# EAGLE design RF12 board (EAGLE 5.08)
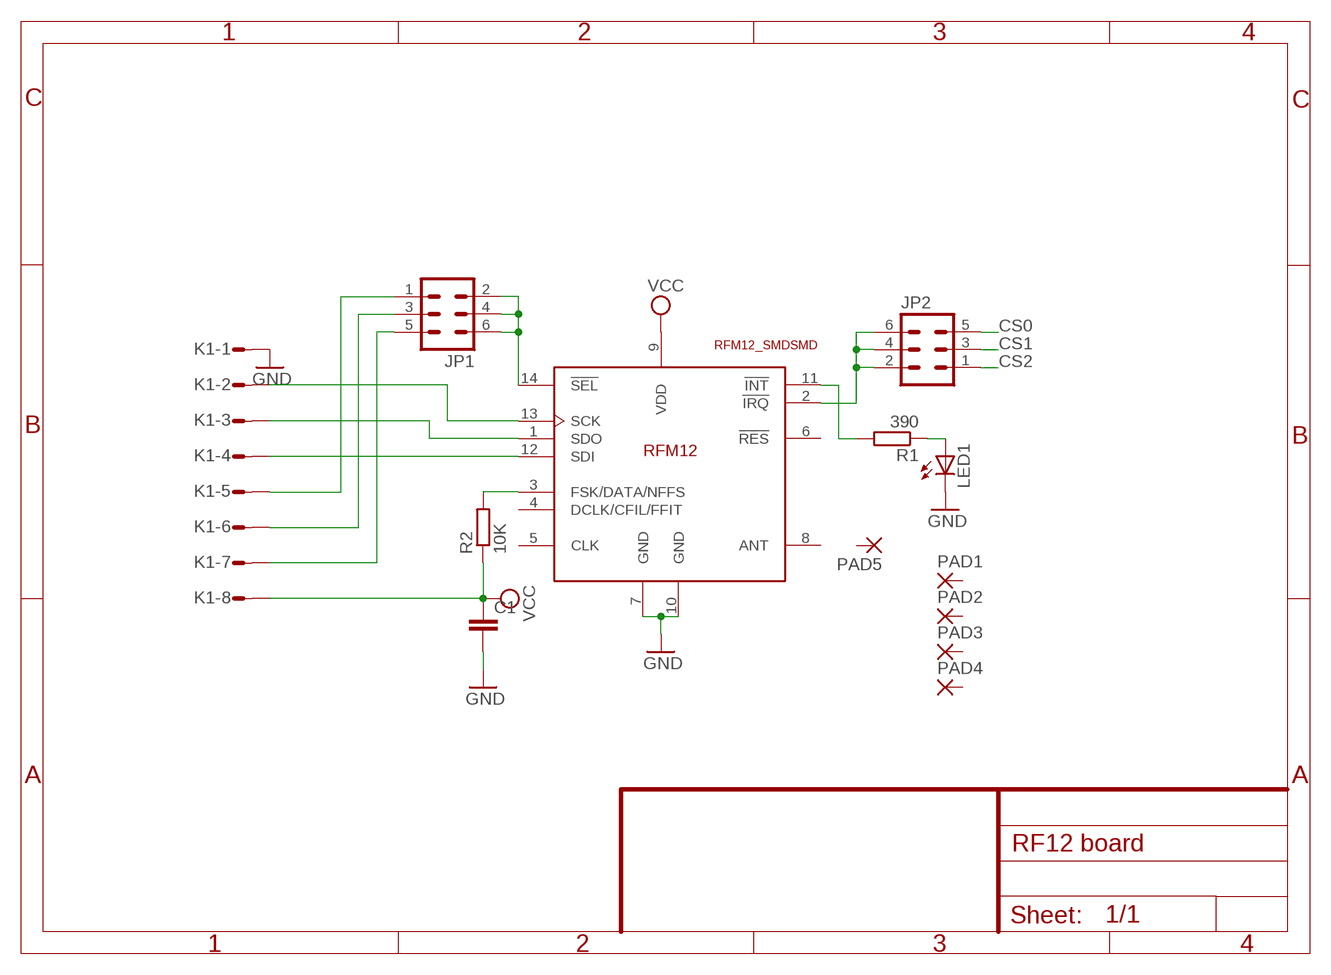
[diagram p0: schematic, sheet 1]

## Parts
C1  C-EUC1210  [C1210]
JP1  MA03-2  [MA03-2]
JP2  MA03-2  [MA03-2]
K1  L08P  [L08P]
LED1  LEDCHIPLED_0805  [CHIPLED_0805]
PAD1  3,81/1,1  [3,81/1,1]
PAD2  3,81/1,1  [3,81/1,1]
PAD3  3,81/1,1  [3,81/1,1]
PAD4  3,81/1,1  [3,81/1,1]
PAD5  3,81/1,1  [3,81/1,1]
R1  390  R-EU_R1206  [R1206]
R2  10K  R-EU_R1206  [R1206]
U1  RFM12_SMDSMD  [RFM12]

## Nets
CS0: JP1.1 JP2.5 K1.5
CS1: JP1.3 JP2.3 K1.6
CS2: JP1.5 JP2.1 K1.7
GND: C1.2 K1.1 LED1.C U1.7(GND) U1.10(GND)
N$2: K1.2 U1.13(SCK)
N$3: R1.2 U1.11(!INT)
N$4: K1.3 U1.1(SDO)
N$6: K1.4 U1.12(SDI)
N$8: R2.2 U1.3(FSK/DATA/NFFS)
N$9: JP2.2 JP2.4 JP2.6 U1.2(!IRQ)
N$10: JP1.2 JP1.4 JP1.6 U1.14(!SEL)
N$16: LED1.A R1.1
VCC: C1.1 K1.8 R2.1 U1.9(VDD)
Unconnected: PAD1.1(P) PAD2.1(P) PAD3.1(P) PAD4.1(P) PAD5.1(P) U1.4(DCLK/CFIL/FFIT) U1.5(CLK) U1.6(!RES) U1.8(ANT)

## Library data of the parts
C1 = rcl:C-EU: CAPACITOR, European symbol
JP1 JP2 = con-lstb:MA03-2: PIN HEADER
K1 = con-amp-mt:L08P: AMP MT CONNECTOR
LED1 = led:LED: LED OSRAM: - CHIPLED LG R971, LG N971, LY N971, LG Q971, LY Q971, LO R971, LY R971 LH N974, LH R974 LS Q976, LO Q976, LY Q976 LO Q996 - Hyper CHIPLED LW Q18S LB Q993, LB Q99A, LB R99A - SideLED LS A670, LO A670, LY A670, LG A670, LP A670 LB A673, LV A673, LT A673, LW A673 LH A674 LY A675 LS A676, LA A676, LO A676, LY A676, LW A676 LS A679, LY A679, LG A679 - Hyper Micro SIDELED® LS Y876, LA Y876, LO Y876, LY Y876 LT Y87S - SmartLED LW L88C, LW L88S LB L89C, LB L89S, LG L890 LS L89K, LO L89K, LY L89K LS L896, LA L896, LO L896, LY L896 - TOPLED LS T670, LO T670, LY T670, LG T670, LP T670 LSG T670, LSP T670, LSY T670, LOP T670, LYG T670 LG T671, LOG T671, LSG T671 LB T673, LV T673, LT T673, LW T673 LH T674 LS T676, LA T676, LO T676, LY T676, LB T676, LH T676, LSB T676, LW T676 LB T67C, LV T67C, LT T67C, LS T67K, LO T67K, LY T67K, LW E67C LS E67B, LA E67B, LO E67B, LY E67B, LB E67C, LV E67C, LT E67C LW T67C LS T679, LY T679, LG T679 LS T770, LO T770, LY T770, LG T770, LP T770 LB T773, LV T773, LT T773, LW T773 LH T774 LS E675, LA E675, LY E675, LS T675 LS T776, LA T776, LO T776, LY T776, LB T776 LHGB T686 LT T68C, LB T68C - Hyper Mini TOPLED® LB M676 - Mini TOPLED Santana® LG M470 LS M47K, LO M47K, LY M47K Source: http://www.osram.convergy.de LUXEON: - LUMILED® LXK2-PW12-R00, LXK2-PW12-S00, LXK2-PW14-U00, LXK2-PW14-V00 LXK2-PM12-R00, LXK2-PM12-S00, LXK2-PM14-U00 LXK2-PE12-Q00, LXK2-PE12-R00, LXK2-PE12-S00, LXK2-PE14-T00, LXK2-PE14-U00 LXK2-PB12-K00, LXK2-PB12-L00, LXK2-PB12-M00, LXK2-PB14-N00, LXK2-PB14-P00, LXK2-PB14-Q00 LXK2-PR12-L00, LXK2-PR12-M00, LXK2-PR14-Q00, LXK2-PR14-R00 LXK2-PD12-Q00, LXK2-PD12-R00, LXK2-PD12-S00 LXK2-PH12-R00, LXK2-PH12-S00 LXK2-PL12-P00, LXK2-PL12-Q00, LXK2-PL12-R00 Source: www.luxeon.com KINGBRIGHT: KA-3528ASYC Source: www.kingbright.com
PAD1-PAD5 = wirepad:3,81/1,1: THROUGH-HOLE PAD
R1 R2 = rcl:R-EU_: RESISTOR, European symbol
U1 = rfm_12:RFM12_SMD: RFM12 is a low costing ISM band transceiver module implemented with unique PLL. It works signal ranges from 315/433/868/915MHZ bands, comply with FCC, ETSI regulation. The SPI interface is used to communicate with microcontroller for parameter setting.

## Board
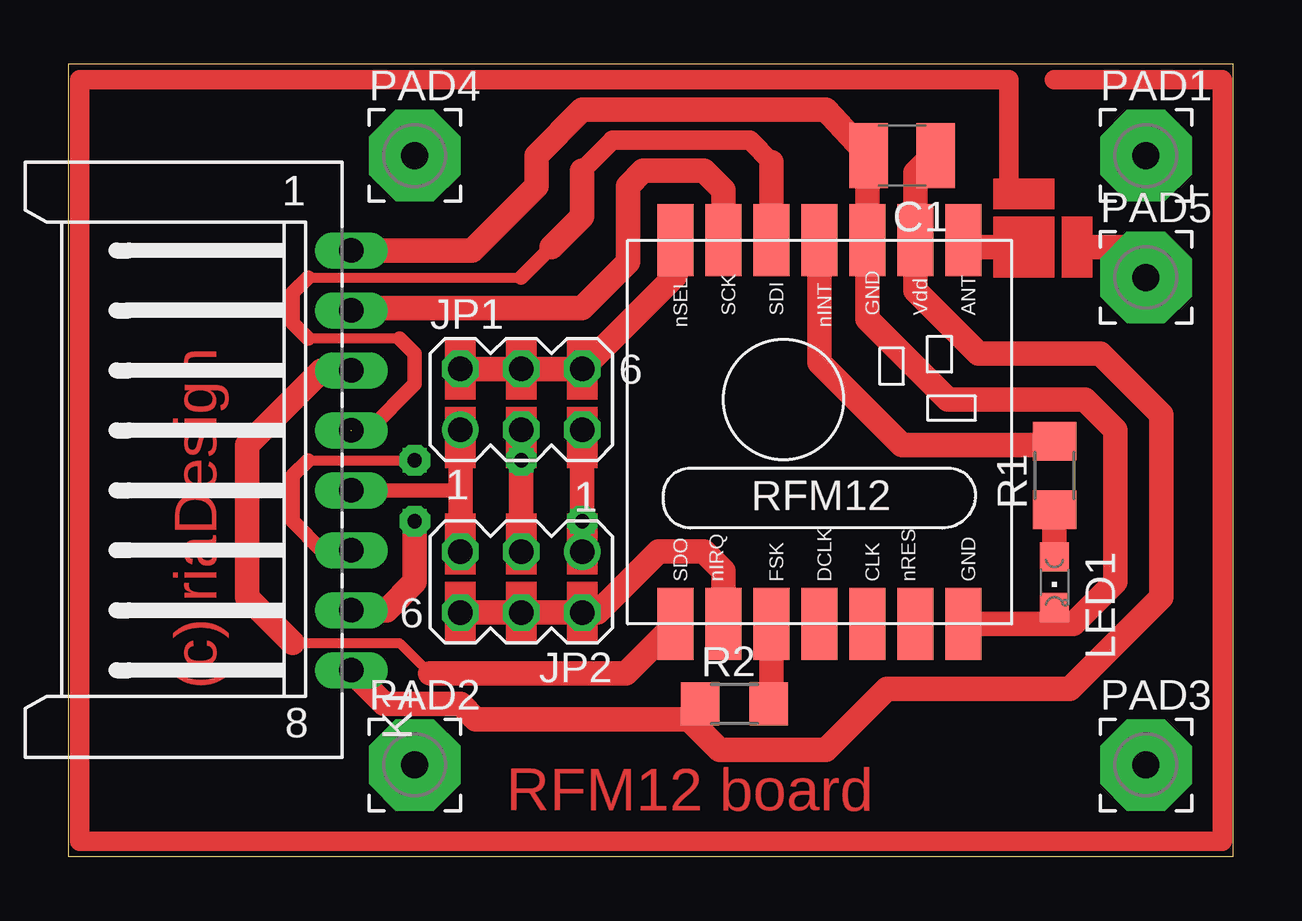
[diagram p1: board, top side]
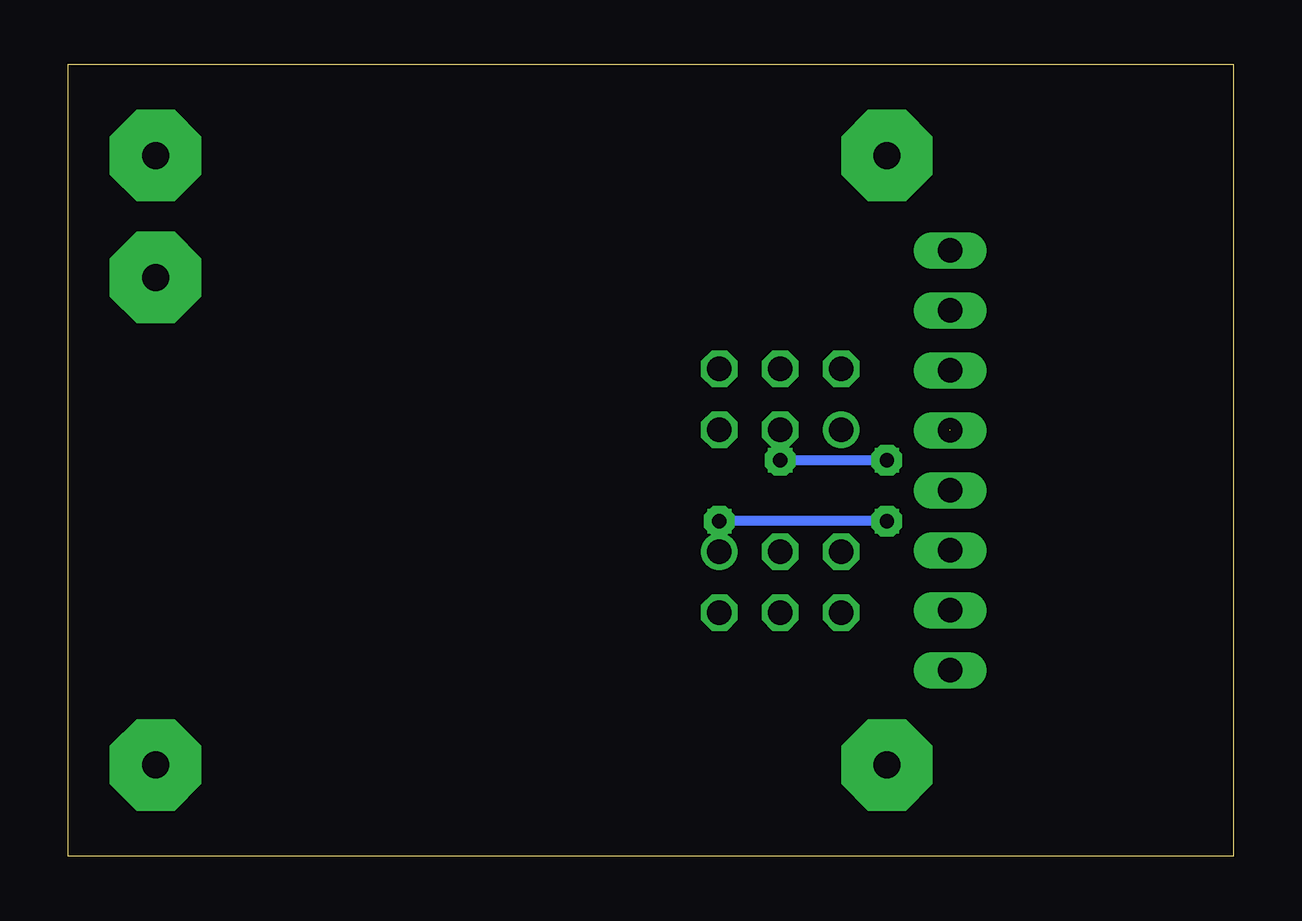
[diagram p2: board, bottom side, seen from below]

Size 48.56 x 33.01 mm. Coordinates in mm from the lower left corner, seen from the top.
Outline: 0,0 48.56,0 48.56,33.01 0,33.01 0,0
Copper layers (1*16): Top 0.035mm / dielectric 1.5mm / Bottom 0.035mm
Design rules "default": minimum track width 10mil, minimum drill 24mil, track to track 8mil, track to pad 8mil, pad to pad 8mil, via to via 8mil, smd to smd 8mil, copper to edge 40mil, drill to drill 8mil, minimum pad ring 10mil, minimum via ring 8mil, stop-mask expansion 4mil, vias tented up to drill 0mil, thermal gap 10mil

### Footprints (pad centres in the part's own frame; a part is rotated, then mirrored left to right if it is on the bottom)
C1210 = smd 1.6 x 2.7: 1 -1.4,0; 2 1.4,0
MA03-2 = drill 1.016 round: 1 -2.54,-1.27 | drill 1.016 octagon: 2 -2.54,1.27; 3 0,-1.27; 4 0,1.27; 5 2.54,-1.27; 6 2.54,1.27
L08P = drill 1.016 long: 1 8.75,-6.25; 2 6.25,-6.25; 3 3.75,-6.25; 4 1.25,-6.25; 5 -1.25,-6.25; 6 -3.75,-6.25; 7 -6.25,-6.25; 8 -8.75,-6.25
CHIPLED_0805 = smd 1.2 x 1.2: A 0,-1.05; C 0,1.05
3,81/1,1 = drill 1.118 pad 3.81 octagon: 1 0,0
R1206 = smd 1.6 x 1.803: 1 -1.422,0; 2 1.422,0
RFM12 = smd 1.5 x 3: 1 -5,-10; 2 -3,-10; 3 -1,-10; 4 1,-10; 5 3,-10; 6 5,-10; 7 7,-10; 8 7,6; 9 5,6; 10 3,6; 11 1,6; 12 -1,6; 13 -3,6; 14 -5,6

### Placement (x,y rotation side)
C1  34.76,29.21 180 top
JP1  18.88,19.05 0 top
JP2  18.88,11.43 180 top
K1  5.55,16.5 90 top
LED1  41.11,11.43 180 top
PAD1  44.92,29.21 0 top
PAD2  14.44,3.8 0 top
PAD3  44.92,3.8 0 top
PAD4  14.44,29.21 0 top
PAD5  44.92,24.12 0 top
R1  41.11,15.87 90 top
R2  27.77,6.34 0 top
U1  30.31,19.68 0 top

### Tracks (layer width: path | path; a pad name or v marks a point on that pad's centre or on a via)
CS0
  Top 0.61: K1.5 16.32,15.26 16.34,15.24
  Top 1.016: JP2.5 16.34,15.24 JP1.1
CS1  (via drill 0.6)
  Top 0.406: 10,16.5 v14.44,16.5
  Top 0.61: K1.6 10.57,12.76 9.36,13.96 9.36,15.87 10,16.5
  Top 1.016: JP2.3 v18.88,16.5 JP1.3
  Bottom 0.406: v14.44,16.5 v18.88,16.5
CS2  (via drill 0.6)
  Top 1.016: K1.7 13.27,10.26 14.44,11.43 v14.44,13.96 | JP2.1 v21.42,13.96 JP1.5
  Bottom 0.406: v14.44,13.96 v21.42,13.96
GND
  Top 1.016: K1.1 16.84,25.25 19.52,27.94 19.52,29.21 21.42,31.11 31.59,31.11 C1.2 33.31,28.11 U1.10 33.31,22.39 36.66,19.05 42.38,19.05 43.65,17.78 43.65,11.43 41.91,9.68 41.11,9.68 | 41.11,9.68 U1.7 | 41.11,9.68 LED1.C
N$1
  Top 0.813: 39.2,27.62 39.2,32.38 0.47,32.38 0.47,0.63 48.09,0.63 48.09,32.38 41.11,32.38
N$2
  Top 1.016: U1.13 27.31,27.76 26.51,28.57 23.96,28.57 23.33,27.94 23.33,24.76 21.42,22.86 11.9,22.86 K1.2
N$3
  Top 1.016: U1.11 31.31,20.59 34.76,17.14 41.11,17.14 R1.2
N$4
  Top 0.406: 15.07,7.61 13.8,8.88 9.36,8.88
  Top 1.016: 9.36,8.88 7.46,10.79 7.46,17.14 10.57,20.25 K1.3 | 15.07,7.61 23.25,7.61 U1.1
N$5  (via drill 0.6 pad 1.27)
  other vias: 14.44,16.5 14.44,13.96 21.42,13.96
N$6  (1 unrouted)
  Top 0.406: 10,24.12 18.88,24.12 | 13.8,21.59 10,21.59
  Top 0.61: 18.88,24.12 20.16,25.39 | 10,24.12 9.36,23.49 9.36,22.22 10,21.59 | 13.8,21.59 14.44,20.95 14.44,19.68 12.54,17.78 11.82,17.78
  Top 0.813: 29.31,28.94 28.41,29.84 22.7,29.84 21.42,28.57
  Top 1.016: 29.31,28.94 U1.12 | 21.42,28.57 21.42,26.66 20.16,25.39
N$7  (via drill 0.6 pad 1.27)
  other vias: 18.88,16.5
N$8
  Top 1.016: U1.3 29.31,6.86 R2.2
N$9
  Top 1.016: JP2.6 JP2.4 JP2.2 22.06,10.16 24.6,12.7 26.51,12.7 27.31,11.88 U1.2
N$10
  Top 1.016: U1.14 25.31,24.21 JP1.6 JP1.4 JP1.2
N$11
  Top 1.016: 42.38,25.39 44.92,25.39 44.92,24.76
N$16
  Top 1.016: LED1.A R1.1
N$18
  Top 1.016: 37.3,25.39 39.2,25.39
VCC
  Top 1.016: C1.1 36.03,29.21 35.31,28.49 U1.9 35.31,23.57 37.93,20.95 43.02,20.95 45.55,18.41 45.55,10.79 41.74,6.98 34.12,6.98 31.59,4.44 27.14,4.44 25.87,5.71 | 25.87,5.71 16.98,5.71 16.34,6.34 13.17,6.34 11.94,7.57 11.94,7.61 K1.8 | R2.1 26.51,5.86 25.87,5.71
(copper drawn outside any net)
  shapes: Top area x16

### Text on the board
Top: (c) riaDesign | RFM12 board